# EAGLE design main_board (EAGLE 9.6.2)
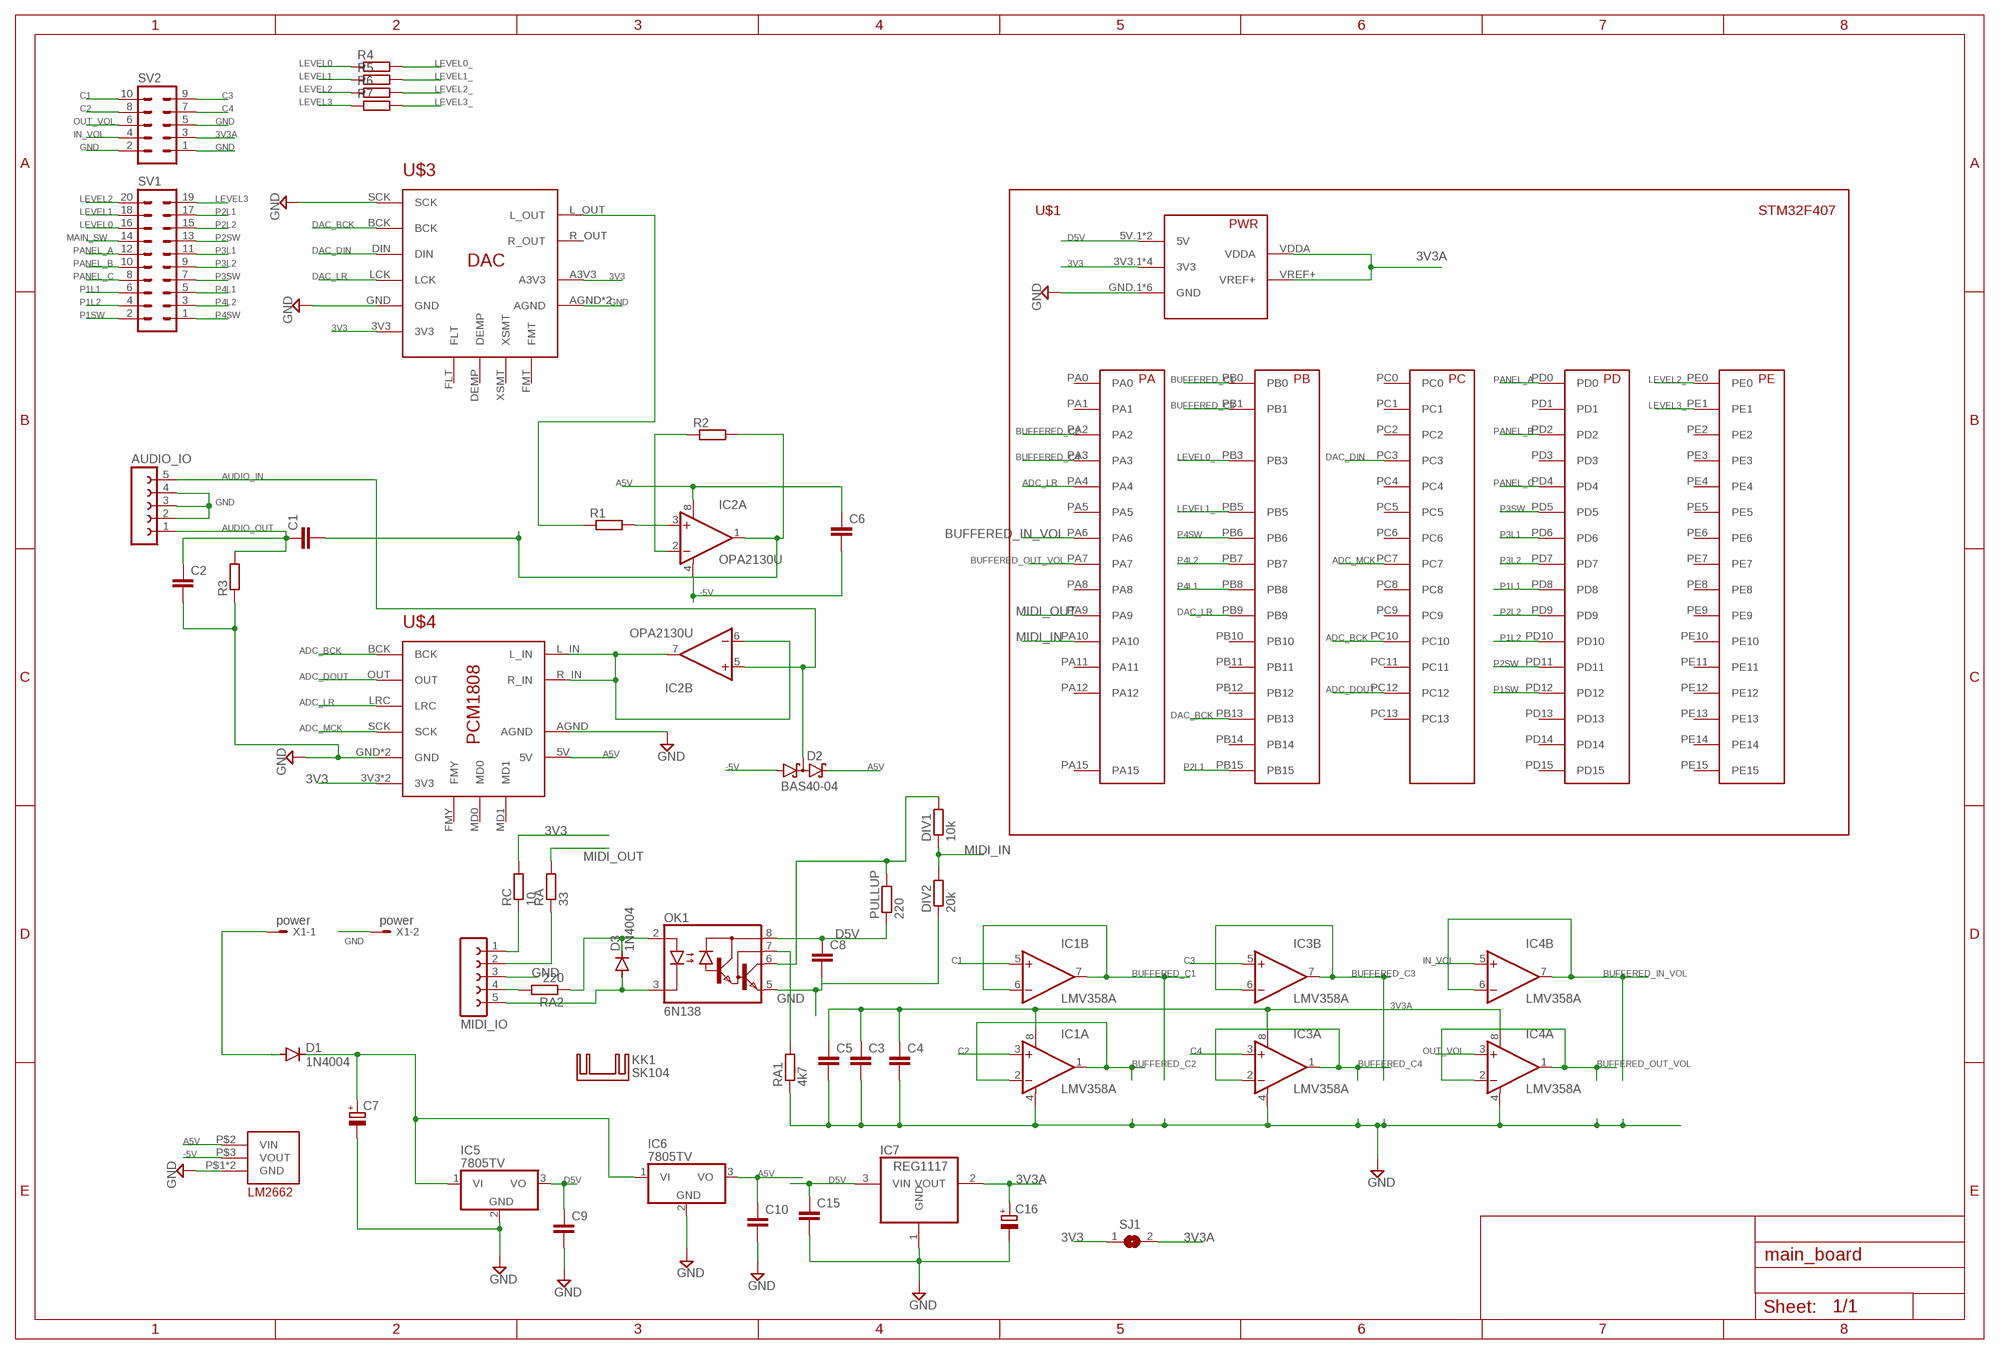
[diagram p0: schematic, sheet 1]

## Parts
AUDIO_IO  FE05-1  [FE05-1]
C1  C5/5.5  [C5B5.5]
C2  C2,5-3  [C2.5-3]
C3  C-EUC0402  [C0402]
C4  C-EUC0402  [C0402]
C5  C-EUC0402  [C0402]
C6  C-EUC0402  [C0402]
C7  CPOL-EUE2.5-7  [E2,5-7]
C8  C-EU025-024X044  [C025-024X044]
C9  C-EU025-024X044  [C025-024X044]
C10  C-EU025-024X044  [C025-024X044]
C15  C-EUC0402  [C0402]
C16  CPOL-EUTT2D6L  [TT2D6L]
D1  1N4004  [DO41-10]
D2  BAS40-04  [SOT23]
D3  1N4004  [DO41-10]
DIV1  10k  R-EU_0204/2V  [0204V]
DIV2  20k  R-EU_0204/2V  [0204V]
IC1  LMV358A  OPA2130U  [SO08]
IC2  OPA2130U  [SO08]
IC3  LMV358A  OPA2130U  [SO08]
IC4  LMV358A  OPA2130U  [SO08]
IC5  7805TV  [TO220V]
IC6  7805TV  [TO220V]
IC7  REG1117  [SOT223]
KK1  SK104  [SK104]
MIDI_IO  FE05-1  [FE05-1]
OK1  6N138  [DIL08]
PULLUP  220  R-EU_0204/2V  [0204V]
R1  R-EU_0204/2V  [0204V]
R2  R-EU_0204/2V  [0204V]
R3  R-EU_0204/2V  [0204V]
R4  R-EU_R0402  [R0402]
R5  R-EU_R0402  [R0402]
R6  R-EU_R0402  [R0402]
R7  R-EU_R0402  [R0402]
RA  33  R-EU_0204/2V  [0204V]
RA1  4k7  R-EU_0204/2V  [0204V]
RA2  220  R-EU_0204/2V  [0204V]
RC  10  R-EU_0204/2V  [0204V]
SJ1  SJ  [SJ]
SV1  MA10-2  [MA10-2]
SV2  MA05-2  [MA05-2]
U$1  DEVEBOX  [DEVEBOX]
U$2  LM2662_MODULE  [LM2662_MODULE]
U$3  PCM510XA  [DAC_MODULE]
U$4  PCM1808  [ADC_MODULE]
X1  power  332-02  [332-02]

## Nets
3V3: RC.2 SJ1.1 U$1.3V3.1(3V3) U$1.3V3.2(3V3) U$1.3V3.3(3V3) U$1.3V3.4(3V3) U$3.3V3 U$3.A3V3 U$4.3V3 U$4.3V3.1(3V3)
3V3A: C3.1 C4.1 C5.1 C16.+ IC1.8(A:V+) IC3.8(A:V+) IC4.8(A:V+) IC7.2(VOUT) SJ1.2 SV2.3 U$1.VDDA U$1.VREF+
-5V: C6.2 D2.1(A1) IC2.4(A:V-) U$2.P$3(VOUT)
A5V: C6.1 C10.1 D2.2(C2) IC2.8(A:V+) IC6.3(VO) U$2.P$2(VIN) U$4.5V
ADC_BCK: U$1.PC10 U$4.BCK
ADC_DOUT: U$1.PC12 U$4.OUT
ADC_LR: U$1.PA4 U$4.LRC
ADC_MCK: U$1.PC7 U$4.SCK
AUDIO_IN: AUDIO_IO.5 D2.3(C1A2) IC2.5(B:+IN)
AUDIO_OUT: R1.1 U$3.L_OUT
BUFFERED_C1: IC1.6(B:-IN) IC1.7(B:OUT) U$1.PB0
BUFFERED_C2: IC1.1(A:OUT) IC1.2(A:-IN) U$1.PA2
BUFFERED_C3: IC3.6(B:-IN) IC3.7(B:OUT) U$1.PB1
BUFFERED_C4: IC3.1(A:OUT) IC3.2(A:-IN) U$1.PA3
BUFFERED_IN_VOL: IC4.6(B:-IN) IC4.7(B:OUT) U$1.PA6
BUFFERED_OUT_VOL: IC4.1(A:OUT) IC4.2(A:-IN) U$1.PA7
C1: IC1.5(B:+IN) SV2.10
C2: IC1.3(A:+IN) SV2.8
C3: IC3.5(B:+IN) SV2.9
C4: IC3.3(A:+IN) SV2.7
D5V: C8.1 C9.1 C15.1 IC5.3(VO) IC7.3(VIN) OK1.8(VCC) PULLUP.1 U$1.5V.1(5V) U$1.5V.2(5V)
DAC_BCK: U$1.PB13 U$3.BCK
DAC_DIN: U$1.PC3 U$3.DIN
DAC_LR: U$1.PB9 U$3.LCK
GND: AUDIO_IO.2 AUDIO_IO.3 AUDIO_IO.4 C2.2 C3.2 C4.2 C5.2 C7.- C8.2 C9.2 C10.2 C15.2 C16.- DIV2.1 IC1.4(A:V-) IC3.4(A:V-) IC4.4(A:V-) IC5.2(GND) IC6.2(GND) IC7.1(GND) MIDI_IO.3 OK1.5(GND) R3.1 RA1.1 SV2.1 SV2.2 SV2.5 U$1.GND4.(GND) U$1.GND.1(GND) U$1.GND.2(GND) U$1.GND.3(GND) U$1.GND.6(GND) U$1.GND.7(GND) U$2.P$1(GND) U$2.P$4(GND) U$3.AGND U$3.AGND.1(AGND) U$3.GND U$3.SCK U$4.AGND U$4.GND U$4.GND.1(GND) X1.2
IN_VOL: IC4.5(B:+IN) SV2.4
LEVEL0: R4.1 SV1.16
LEVEL0_: R4.2 U$1.PB3
LEVEL1: R5.1 SV1.18
LEVEL1_: R5.2 U$1.PB5
LEVEL2: R6.1 SV1.20
LEVEL2_: R6.2 U$1.PE0
LEVEL3: R7.1 SV1.19
LEVEL3_: R7.2 U$1.PE1
MAIN_SW: SV1.14
MIDI_IN: DIV1.1 DIV2.2 U$1.PA10
MIDI_OUT: RA.2 U$1.PA9
N$1: C7.+ D1.C IC5.1(VI) IC6.1(VI)
N$2: IC2.6(B:-IN) IC2.7(B:OUT) U$4.L_IN U$4.R_IN
N$3: D1.A X1.1
N$4: AUDIO_IO.1 C1.1 C2.1 R3.2
N$5: D3.A MIDI_IO.5 OK1.3(C)
N$6: D3.C OK1.2(A) RA2.1
N$7: DIV1.2 OK1.6(VO) PULLUP.2
N$8: MIDI_IO.1 RC.1
N$9: MIDI_IO.2 RA.1
N$11: IC2.3(A:+IN) R1.2
N$12: C1.2 IC2.1(A:OUT) R2.2
N$13: IC2.2(A:-IN) R2.1
N$14: OK1.7(VB) RA1.2
N$15: MIDI_IO.4 RA2.2
OUT_VOL: IC4.3(A:+IN) SV2.6
P1L1: SV1.6 U$1.PD8
P1L2: SV1.4 U$1.PD10
P1SW: SV1.2 U$1.PD12
P2L1: SV1.17 U$1.PB15
P2L2: SV1.15 U$1.PD9
P2SW: SV1.13 U$1.PD11
P3L1: SV1.11 U$1.PD6
P3L2: SV1.9 U$1.PD7
P3SW: SV1.7 U$1.PD5
P4L1: SV1.5 U$1.PB8
P4L2: SV1.3 U$1.PB7
P4SW: SV1.1 U$1.PB6
PANEL_A: SV1.12 U$1.PD0
PANEL_B: SV1.10 U$1.PD2
PANEL_C: SV1.8 U$1.PD4
Unconnected: U$1.PA0 U$1.PA1 U$1.PA5 U$1.PA8 U$1.PA11 U$1.PA12 U$1.PA15 U$1.PB10 U$1.PB11 U$1.PB12 U$1.PB14 U$1.PC0 U$1.PC1 U$1.PC2 U$1.PC4 U$1.PC5 U$1.PC6 U$1.PC8 U$1.PC9 U$1.PC11 U$1.PC13 U$1.PD1 U$1.PD3 U$1.PD13 U$1.PD14 U$1.PD15 U$1.PE2 U$1.PE3 U$1.PE4 U$1.PE5 U$1.PE6 U$1.PE7 U$1.PE8 U$1.PE9 U$1.PE10 U$1.PE11 U$1.PE12 U$1.PE13 U$1.PE14 U$1.PE15 U$3.DEMP U$3.FLT U$3.FMT U$3.R_OUT U$3.XSMT U$4.FMY U$4.MD0 U$4.MD1

## Library data of the parts
AUDIO_IO MIDI_IO = con-lsta:FE05-1: FEMALE HEADER; OC_FARNELL: unknown; OC_NEWARK: unknown
C1 C2 = capacitor-wima:C: CAPACITOR naming: grid - package width
C3-C6 C8-C10 C15 = rcl:C-EU: CAPACITOR, European symbol; SPICEPREFIX: C
C7 C16 = rcl:CPOL-EU: POLARIZED CAPACITOR, European symbol; SPICEPREFIX: C
D1 D3 = diode:1N4004: DIODE general purpose rectifier, 1 A
D2 = diode:BAS40-04: Silicon Schottky Diodes General-purpose diode for high-speed switching
DIV1 DIV2 PULLUP R1-R7 RA RA1 RA2 RC = rcl:R-EU_: RESISTOR, European symbol; SPICEPREFIX: R
IC1-IC4 = burr-brown:OPA2130: Operational Amplifier; MF: TEXAS INSTRUMENTS; MPN: OPA2130UA; OC_FARNELL: 1459554; OC_NEWARK: 35C1841
IC5 IC6 = linear:78*: Positive VOLTAGE REGULATOR Source: http://cache.national.com/ds/LM/LM78L05.pdf http://www.fairchildsemi.com/ds/LM/LM7805.pdf
IC7 = burr-brown:REG1117: 800mA and 1A Low Dropout (LDO) Positive Regulator 1.8V, 2.5V, 2.85V, 3.3V, 5V, and Adj; MPN: REG1117; OC_FARNELL: 1097566; OC_NEWARK: 14P6981
KK1 = heatsink:SK104: HEATSINK manufacturer Fischer/distributor Buerklin
OK1 = optocoupler:6N138: MOTOROLA OPTO COUPLER; MF: VISHAY/TELEFUNKEN; MPN: 6N138; OC_FARNELL: 9860150; OC_NEWARK: 35K5294
SJ1 = jumper:SJ: SMD solder JUMPER
SV1 = con-lstb:MA10-2: PIN HEADER; OC_FARNELL: unknown; OC_NEWARK: unknown
SV2 = con-lstb:MA05-2: PIN HEADER; OC_FARNELL: unknown; OC_NEWARK: unknown
U$1 = ali_modules:DEVEBOX
U$2 = ali_modules:LM2662_MODULE
U$3 = ali_modules:PCM510XA
U$4 = ali_modules:PCM1808
X1 = con-garry:332-02: 2 Pin - 2mm Dual Row Source: www.mpe-connector.de / garry_shortform_2012.pdf

## Board
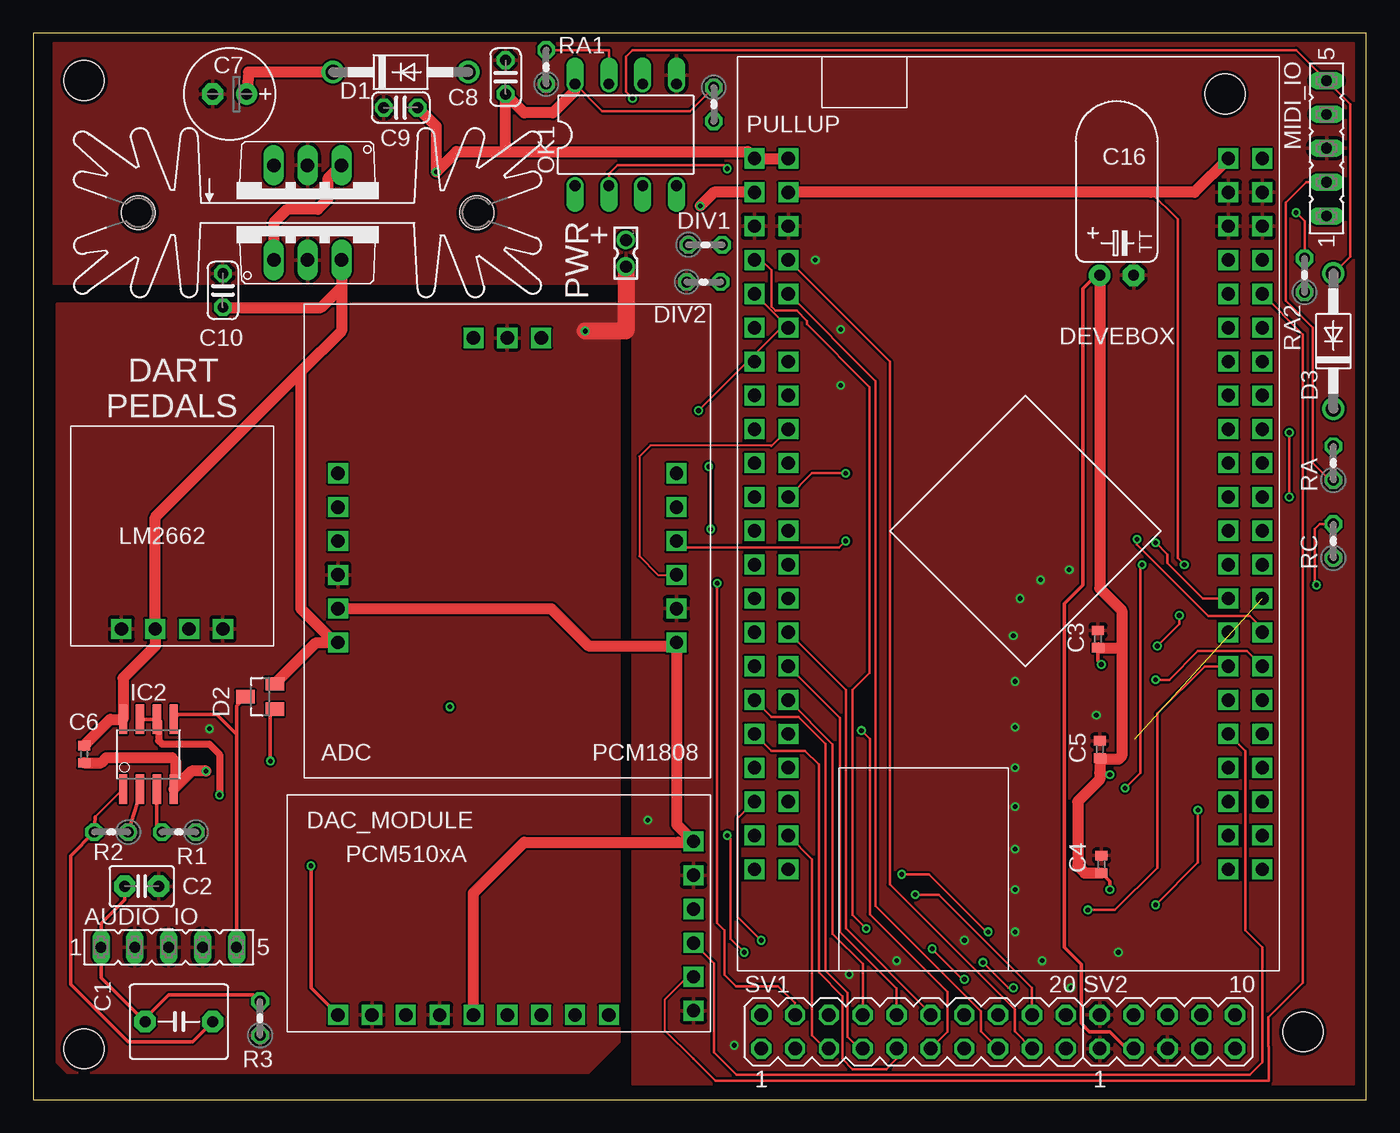
[diagram p1: board, top side]
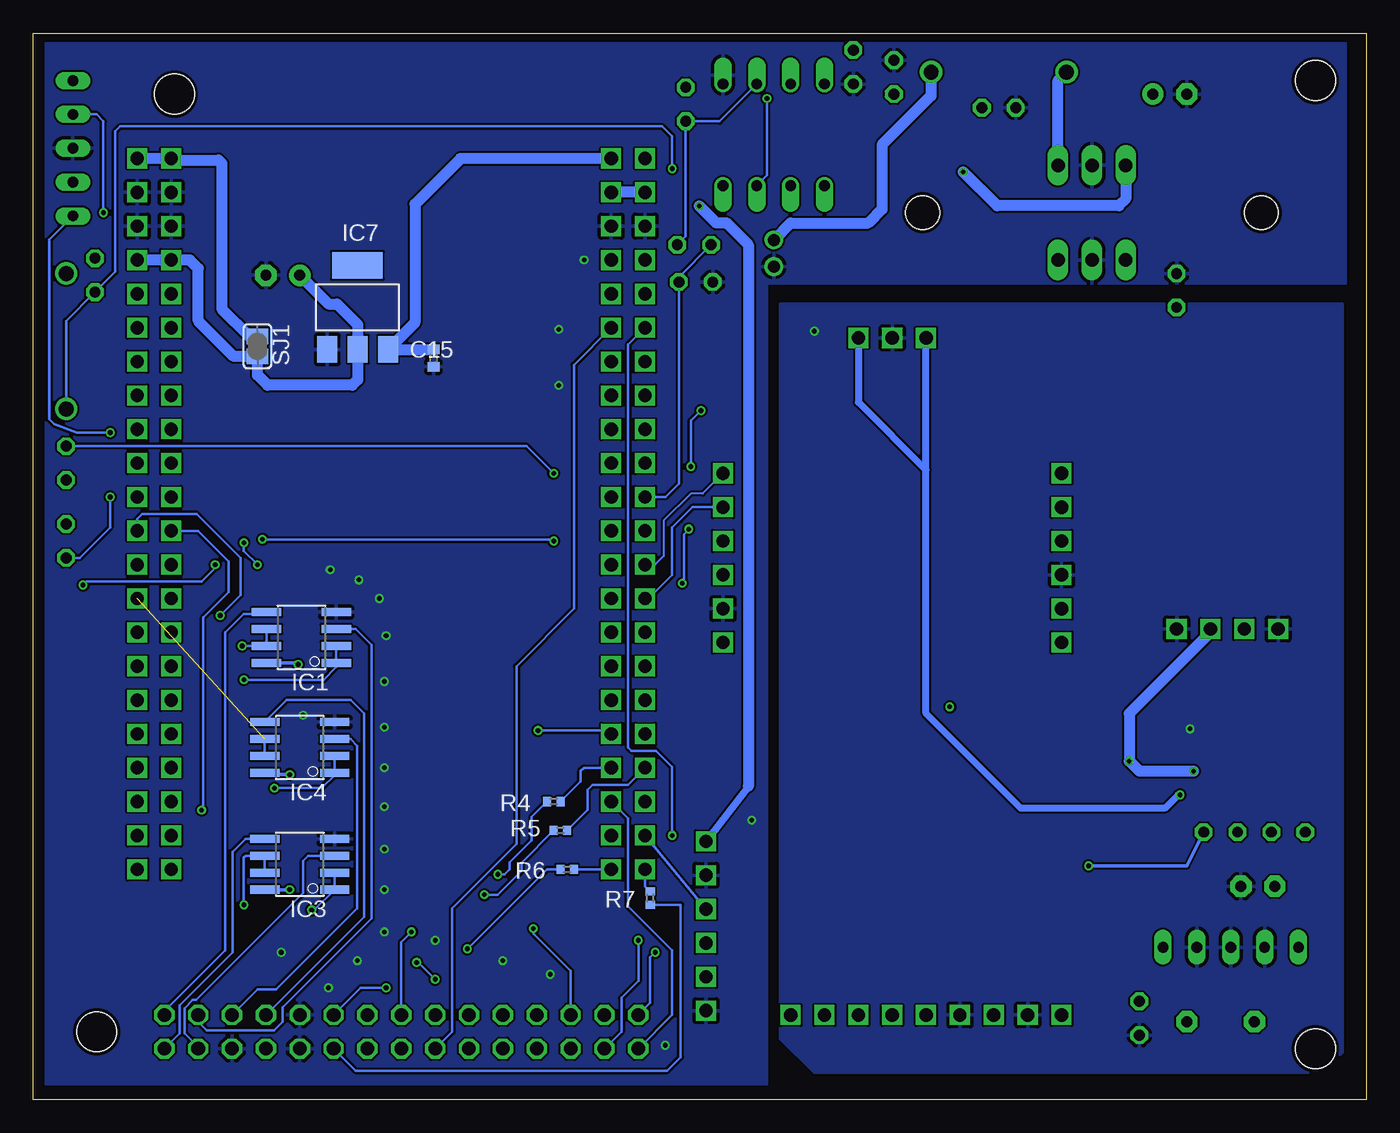
[diagram p2: board, bottom side, seen from below]

Size 100 x 80 mm. Coordinates in mm from the lower left corner, seen from the top.
Outline: 0,0 100,0 100,80 0,80 0,0
Copper layers (1*16): Top 0.035mm / dielectric 1.5mm / Bottom 0.035mm
Design rules "SeeedStudio_2layer_DRU_no_angle_20140221": minimum track width 6mil, minimum drill 12mil, track to track 6mil, track to pad 6mil, pad to pad 6mil, via to via 6mil, smd to smd 0mil, copper to edge 10mil, drill to drill 10mil, minimum pad ring 10mil, minimum via ring 6mil, stop-mask expansion 2mil, vias tented up to drill 100mil, thermal gap 10mil
Holes 3 mm at 3.81,76.45 89.41,75.44 95.25,5.08 3.81,3.81

### Footprints (pad centres in the part's own frame; a part is rotated, then mirrored left to right if it is on the bottom)
FE05-1 = drill 0.813 long: 1 -5.08,0; 2 -2.54,0; 3 0,0; 4 2.54,0; 5 5.08,0
C5B5.5 = drill 0.813 pad 1.6 octagon: 1 -2.54,0; 2 2.54,0
C2.5-3 = drill 0.813 pad 1.6 octagon: 1 -1.27,0; 2 1.27,0
C0402 = smd 0.7 x 0.9: 1 -0.65,0; 2 0.65,0
E2,5-7 = drill 0.813 pad 1.6: + -1.27,0 | drill 0.813 pad 1.6 octagon: - 1.27,0
C025-024X044 = drill 0.813 octagon: 1 -1.27,0; 2 1.27,0
TT2D6L = drill 0.813 pad 1.6: + -1.27,0 | drill 0.813 pad 1.6 octagon: - 1.27,0
DO41-10 = drill 1.118: A 5.08,0; C -5.08,0
SOT23 = smd 1 x 1.4: 1 -0.95,-1.1; 2 0.95,-1.1; 3 0,1.1
0204V = drill 0.813 octagon: 1 -1.27,0; 2 1.27,0
SO08 = smd 0.61 x 2.21: 1 -1.905,-2.616; 2 -0.635,-2.616; 3 0.635,-2.616; 4 1.905,-2.616; 5 1.905,2.616; 6 0.635,2.616; 7 -0.635,2.616; 8 -1.905,2.616
TO220V = drill 1.016 long: 1 -2.54,-2.54; 2 0,-2.54; 3 2.54,-2.54
SOT223 = smd 1.499 x 2.007: 1 -2.261,-3.15; 2 0.025,-3.15; 3 2.311,-3.15 | smd 3.81 x 2.007: 4 0,3.15
SK104 = hole 2.54: -12.7,-0.762; 12.7,-0.762
DIL08 = drill 0.813 offset: 1 -3.81,-3.81; 2 -1.27,-3.81; 3 1.27,-3.81; 4 3.81,-3.81; 5 3.81,3.81; 6 1.27,3.81; 7 -1.27,3.81; 8 -3.81,3.81
R0402 = smd 0.6 x 0.7: 1 -0.5,0; 2 0.5,0
SJ = smd 1.168 x 1.6: 1 -0.762,0; 2 0.762,0
MA10-2 = drill 1.016 octagon: 1 -11.43,-1.27; 2 -11.43,1.27; 3 -8.89,-1.27; 4 -8.89,1.27; 5 -6.35,-1.27; 6 -6.35,1.27; 7 -3.81,-1.27; 8 -3.81,1.27; 9 -1.27,-1.27; 10 -1.27,1.27; 11 1.27,-1.27; 12 1.27,1.27; 13 3.81,-1.27; 14 3.81,1.27; 15 6.35,-1.27; 16 6.35,1.27; 17 8.89,-1.27; 18 8.89,1.27; 19 11.43,-1.27; 20 11.43,1.27
MA05-2 = drill 1.016 octagon: 1 -5.08,-1.27; 2 -5.08,1.27; 3 -2.54,-1.27; 4 -2.54,1.27; 5 0,-1.27; 6 0,1.27; 7 2.54,-1.27; 8 2.54,1.27; 9 5.08,-1.27; 10 5.08,1.27
DEVEBOX = drill 1 square: 3V3.1 17.78,27.94; 3V3.2 20.32,27.94; 3V3.3 -17.78,25.4; 3V3.4 -15.24,25.4; 5V.1 -17.78,27.94; 5V.2 -15.24,27.94; GND4. 20.32,22.86; GND.1 17.78,25.4; GND.2 20.32,25.4; GND.3 17.78,22.86; GND.6 -17.78,22.86; GND.7 -15.24,22.86; PA0 20.32,-12.7; PA1 17.78,-12.7; PA2 20.32,-10.16; PA3 17.78,-10.16; PA4 20.32,-7.62; PA5 17.78,-7.62; PA6 20.32,-5.08; PA7 17.78,-5.08; PA8 -17.78,5.08; PA9 -15.24,2.54; PA10 -17.78,2.54; PA11 -15.24,0; PA12 -17.78,0; PA15 -15.24,-2.54; PB0 20.32,0; PB1 17.78,0; PB3 -15.24,-17.78; PB5 -17.78,-17.78; PB6 -15.24,-20.32; PB7 -17.78,-20.32; PB8 -15.24,-22.86; PB9 -17.78,-22.86; PB10 17.78,12.7; PB11 20.32,15.24; PB12 17.78,15.24; PB13 20.32,17.78; PB14 17.78,17.78; PB15 -15.24,20.32; PC0 20.32,-17.78; PC1 17.78,-17.78; PC2 20.32,-15.24; PC3 17.78,-15.24; PC4 20.32,-2.54; PC5 17.78,-2.54; PC6 -17.78,10.16; PC7 -15.24,7.62; PC8 -17.78,7.62; PC9 -15.24,5.08; PC10 -17.78,-2.54; PC11 -15.24,-5.08; PC12 -17.78,-5.08; PC13 17.78,-20.32; PD0 -15.24,-7.62; PD1 -17.78,-7.62; PD2 -15.24,-10.16; PD3 -17.78,-10.16; PD4 -15.24,-12.7; PD5 -17.78,-12.7; PD6 -15.24,-15.24; PD7 -17.78,-15.24; PD8 -17.78,20.32; PD9 -15.24,17.78; PD10 -17.78,17.78; PD11 -15.24,15.24; PD12 -17.78,15.24; PD13 -15.24,12.7; PD14 -17.78,12.7; PD15 -15.24,10.16; PE0 -15.24,-25.4; PE1 -17.78,-25.4; PE2 20.32,-25.4; PE3 17.78,-25.4; PE4 20.32,-22.86; PE5 17.78,-22.86; PE6 20.32,-20.32; PE7 20.32,2.54; PE8 17.78,2.54; PE9 20.32,5.08; PE10 17.78,5.08; PE11 20.32,7.62; PE12 17.78,7.62; PE13 20.32,10.16; PE14 17.78,10.16; PE15 20.32,12.7; VDDA 17.78,20.32; VREF+ 20.32,20.32
LM2662_MODULE = drill 1 square: P$1 -3.81,2.54; P$2 -3.81,0; P$3 -3.81,-2.54; P$4 -3.81,-5.08
DAC_MODULE = drill 1 square: 3V3 -17.78,-6.668; A3V3 -1.27,6.35; AGND 6.35,6.35; AGND.1 1.27,6.35; BCK -17.78,3.493; DEMP -8.89,6.35; DIN -17.78,0.953; FLT -11.43,6.35; FMT -3.81,6.35; GND -17.78,-4.128; L_OUT 8.89,6.35; LCK -17.78,-1.587; R_OUT 3.81,6.35; SCK -17.78,6.032; XSMT -6.35,6.35
ADC_MODULE = drill 1 square: 3V3 -10.16,-5.08; 3V3.1 15.24,-7.62; 5V -10.16,-7.62; AGND 2.54,15.24; BCK 15.24,5.08; FMY -10.16,5.08; GND -10.16,-2.54; GND.1 15.24,-5.08; L_IN 5.08,15.24; LRC 15.24,0; MD0 -10.16,0; MD1 -10.16,2.54; OUT 15.24,2.54; R_IN 0,15.24; SCK 15.24,-2.54
332-02 = drill 0.9 pad 1.27: 1 0,-1; 2 0,1

### Placement (x,y rotation side)
AUDIO_IO  10.16,11.43 0 top
C1  10.92,5.84 0 top
C2  8.13,16 0 top
C3  79.88,34.54 90 top
C4  80.14,17.65 90 top
C5  80.01,26.27 90 top
C6  3.81,25.91 270 top
C7  14.73,75.44 180 top
C8  35.43,76.71 90 top
C9  27.56,74.42 180 top
C10  14.22,60.71 90 top
C15  69.98,55.63 270 bottom
C16  81.28,61.85 0 top
D1  27.56,77.09 0 top
D2  17.02,30.23 90 top
D3  97.54,56.9 90 top
DIV1  50.42,64.14 0 top
DIV2  50.29,61.34 0 top
IC1  79.88,34.67 90 bottom
IC2  8.64,25.91 0 top
IC3  80.01,17.65 90 bottom
IC4  80.01,26.42 90 bottom
IC5  20.57,67.56 180 top
IC6  20.57,65.53 0 top
IC7  75.69,59.44 0 bottom
KK1  20.57,67.31 0 top
MIDI_IO  97.03,71.37 90 top
OK1  44.45,72.39 0 top
PULLUP  51.05,74.68 270 top
R1  10.92,20.07 180 top
R2  5.84,20.07 180 top
R3  17.02,6.1 90 top
R4  60.96,22.35 0 bottom
R5  60.45,20.19 0 bottom
R6  59.94,17.27 0 bottom
R7  53.72,15.11 90 bottom
RA  97.54,47.75 90 top
RA1  38.48,77.47 90 top
RA2  95.38,61.85 90 top
RC  97.54,41.91 90 top
SJ1  83.19,56.52 270 bottom
SV1  66.04,5.08 0 top
SV2  85.09,5.08 0 top
U$1  71.88,42.67 0 top
U$2  9.14,39.12 90 top
U$3  31.75,12.7 180 top
U$4  33.02,41.91 0 top
X1  44.45,63.5 180 top

### Tracks (layer width: path | path; a pad name or v marks a point on that pad's centre or on a via)
3V3  (via drill 0.35)
  Top 0.203: v86.36,40.13 85.85,40.64 85.85,66.04 83.82,68.07 | v96.27,38.61 96.14,38.73 96.14,42.8 96.52,43.18 RC.2
  Top 0.813: U$1.3V3.1 87.12,68.07 83.82,68.07 U$1.3V3.4 | U$3.A3V3 33.02,15.49 36.83,19.3 48.39,19.3 49.47,19.3 U$3.3V3 48.26,20.64 U$4.3V3.1 48.01,34.04 41.66,34.04 38.86,36.83 U$4.3V3 | U$1.3V3.3 51.05,68.07 v50.04,67.06
  Bottom 0.203: v96.27,38.61 96.01,38.86 87.38,38.86 86.36,39.88 v86.36,40.13
  Bottom 0.508: 46.35,23.5 U$3.3V3
  Bottom 0.813: 46.35,23.5 46.35,64.14 48.01,65.79 48.77,65.79 v50.04,67.06 | U$1.3V3.2 U$1.3V3.1 89.53,70.48 86.11,70.48 85.85,70.23 85.85,59.31 83.82,57.28 SJ1.1 | U$1.3V3.3 U$1.3V3.4
3V3A  (via drill 0.35)
  Top 0.254: v80.14,32.64 79.88,32.89 C3.1 | 80.01,24.51 80.64,24.51 v80.77,24.38 | C4.1 80.77,16.37 v80.77,15.75 | SV2.3 82.04,3.81 80.77,5.08 79.25,5.08 78.61,5.71 78.61,10.16 77.34,11.43 77.34,37.21 78.74,38.61 78.74,60.83 79.76,61.85 C16.+
  Top 0.813: C16.+ 80.01,38.35 81.66,36.7 81.66,33.91 | 81.66,33.91 81.66,25.78 81.41,25.53 80.11,25.53 C5.1 80.01,24.51 80.01,24 78.36,22.35 78.36,17.53 78.88,17 C4.1 | C3.1 81.65,33.89 81.66,33.91
  Bottom 0.254: IC1.8 80.26,32.77 v80.14,32.64 | v80.77,24.38 82.5,24.38 IC4.8 | v80.77,15.75 IC3.8
  Bottom 0.813: C16.+ 77.85,59.69 77.22,59.69 75.67,58.14 IC7.2 75.67,54 76.07,53.59 82.42,53.59 83.19,54.36 SJ1.2 84.96,55.75 87.63,58.42 87.63,62.36 88.27,62.99 U$1.VDDA U$1.VREF+
-5V  (via drill 0.35)
  Top 0.254: D2.1 17.78,28.94 v17.78,25.4 | 10.41,25.65 10.67,25.4 | 10.67,23.42 IC2.4
  Top 0.813: v12.95,24.64 11.89,24.64 IC2.4 | C6.2 5.08,25.26 5.48,25.65 10.41,25.65 | 10.67,25.4 10.67,23.42
  Bottom 0.813: v12.95,24.64 17.02,24.64 v17.78,25.4 17.78,28.96 11.68,35.05 U$2.P$3
A5V
  Top 0.813: D2.2 21.23,34.29 U$4.5V 22.61,34.29 20.07,36.83 20.07,54.61 | 20.07,54.61 23.11,57.66 23.11,60.96 | IC6.3 23.11,60.96 | 20.07,54.61 9.14,43.69 U$2.P$2 9.14,34.04 6.73,31.62 IC2.8 5.78,28.52 C6.1 | C10.1 21.59,59.44 23.11,60.96
ADC_BCK
  Bottom 0.152: U$4.BCK 49.78,45.47 50.67,45.47 52.7,43.43 52.7,40.77 53.34,40.13 U$1.PC10
ADC_DOUT
  Bottom 0.203: U$4.OUT 50.55,44.45 52.07,42.93 52.07,39.37 53.85,37.59 U$1.PC12
ADC_LR  (via drill 0.35)
  Top 0.203: v60.96,41.91 60.45,41.4 48.77,41.4 U$4.LRC | v82.8,42.04 82.8,41.66 88.17,36.29 91.27,36.29 92.2,35.36 U$1.PA4
  Bottom 0.203: v60.96,41.91 61.09,42.04 v82.8,42.04
ADC_MCK
  Top 0.152: U$1.PC7 55.44,49.09 | 55.37,49.02 55.44,49.09 | 55.44,49.09 46.29,49.09 45.47,48.26 45.47,40.77 46.86,39.37 U$4.SCK
AUDIO_IN
  Top 0.254: IC2.5 10.9,28.88 13.74,28.88 15.24,27.38 | AUDIO_IO.5 15.24,27.38 | 15.24,27.38 15.24,29.55 D2.3
AUDIO_OUT  (via drill 0.35)
  Top 0.254: U$3.L_OUT 20.83,8.38 v20.83,17.53
  Bottom 0.254: v20.83,17.53 13.46,17.53 R1.1
BUFFERED_C1  (via drill 0.35)
  Top 0.203: v84.33,34.04 85.98,35.69 v85.98,36.32
  Bottom 0.203: IC1.6 IC1.7 v84.33,34.04 | v85.98,36.32 84.45,37.85 84.45,40.64 87.76,43.94 91.82,43.94 92.2,43.56 U$1.PB0
BUFFERED_C2  (via drill 0.35)
  Top 0.203: v84.2,31.5 85.22,31.5 87.38,33.66 91.06,33.66 U$1.PA2
  Bottom 0.203: IC1.2 IC1.1 77.27,32.46 78.23,31.5 v84.2,31.5
BUFFERED_C3  (via drill 0.35)
  Top 0.203: v87.38,21.72 87.38,17.78 v84.2,14.61
  Bottom 0.203: IC3.7 IC3.6 84.07,18.29 84.2,18.16 v84.2,14.61 | U$1.PB1 87.63,42.67 85.34,40.39 85.34,38.07 87.25,36.16 87.25,21.84 v87.38,21.72
BUFFERED_C4  (via drill 0.35)
  Top 0.203: U$1.PA3 87.88,32.51 84.33,28.96 84.33,17.4 81.15,14.22 v79.12,14.22
  Bottom 0.203: IC3.2 IC3.1 78.92,14.22 v79.12,14.22
BUFFERED_IN_VOL  (1 unrouted)
  Bottom 0.203: IC4.6 IC4.7
BUFFERED_OUT_VOL  (via drill 0.35)
  Top 0.203: v83.19,40.13 83.06,40.01 83.06,24.51 v81.92,23.37 | v84.2,41.78 85.09,40.89 85.09,40.26 87.76,37.59 U$1.PA7
  Bottom 0.203: IC4.2 IC4.1 77.39,24.33 78.36,23.37 v81.92,23.37 | v84.2,41.78 84.2,41.15 v83.19,40.13
C1
  Bottom 0.203: SV2.10 90.17,6.6 85.6,11.18 85.6,35.05 84.2,36.45 82.63,36.45 IC1.5
C2
  Bottom 0.203: SV2.8 87.63,5.84 87,5.21 81.92,5.21 81.28,5.84 81.28,6.93 74.62,13.59 74.62,34.11 75.82,35.31 IC1.3
C3
  Bottom 0.203: SV2.9 89.03,4.95 89.03,7.06 85.04,11.05 85.04,18.59 84.07,19.56 IC3.5
C4
  Bottom 0.203: SV2.7 87.63,3.94 88.65,4.95 88.65,6.86 88.04,7.47 87.78,7.47 79.76,15.49 79.76,17.91 79.38,18.29 IC3.3
D5V  (via drill 0.35)
  Top 0.203: OK1.8 42.67,74.17 49.28,74.17 PULLUP.1
  Top 0.813: 35.31,71.12 35.43,71.25 C8.1 36.83,74.04 38.99,74.04 40.64,75.69 OK1.8 | 35.31,71.12 31.75,71.12 v30.23,69.6 30.23,73.03 C9.1 | 35.31,71.12 53.59,71.12 U$1.5V.1 U$1.5V.2
  Bottom 0.813: IC5.3 18.03,67.56 18.54,67.06 27.69,67.06 v30.23,69.6 | U$1.5V.2 67.94,70.61 71.37,67.18 71.37,58.29 IC7.3 73.37,56.28 C15.1
DAC_BCK
  Top 0.152: U$3.BCK 49.09,9.21 47.37,7.49 47.37,5.21 49.53,3.05
  Top 0.203: U$1.PB13 95.25,57.4 95.25,8.75 92.66,6.15 92.66,4.01 92.71,3.95 92.71,1.4 51.18,1.4 49.53,3.05
DAC_DIN
  Top 0.203: U$1.PC3 90.93,26.16 90.93,12.7 92.2,11.43 92.2,2.79 91.26,1.85 52.76,1.85 51.05,3.56 51.05,10.22 U$3.DIN
DAC_LR
  Bottom 0.203: U$3.LCK U$1.PB9
GND  (via drill 0.35)
  Top 1.27: X1.2 44.45,57.66 v41.4,57.66
  other vias: 58.67,62.99 52.58,4.06 61.21,9.4 64.77,10.41 13.21,27.81 60.58,53.59 60.58,57.78 77.72,39.75 75.56,38.99 74.04,37.59 73.53,34.8 73.66,31.37 73.66,27.94 73.66,24.89 73.66,21.97 73.66,18.8 73.66,15.75 73.66,12.57 75.69,10.41 77.85,8.38 46.1,20.95 79.76,28.83 69.85,11.94 81.41,11.05
  pour Bottom: 1.78,59.69 43.94,59.69 43.94,4.57 41.4,2.03 3.3,2.03 1.78,3.56
  pour Top: 43.94,59.69 43.94,4.32 41.66,2.03 2.54,2.03 1.78,2.79 1.78,59.69
  pour Top: 1.52,79.25 99.06,79.25 99.06,1.14 44.96,1.14 44.96,61.21 1.52,61.21
  pour Bottom: 1.52,79.25 99.06,79.25 99.06,1.14 44.96,1.14 44.96,61.21 1.52,61.21
IN_VOL
  Bottom 0.203: SV2.4 75.18,13.72 75.18,28.96 76.2,29.97 80.97,29.97 IC4.5
LEVEL0  (via drill 0.35)
  Top 0.203: v65.15,16.89 67.18,16.89 71.5,12.57 v71.63,12.57
  Bottom 0.203: v65.15,16.89 64.64,16.89 64.26,17.27 64.26,17.78 62.61,19.43 62.61,21.2 R4.1 | v71.63,12.57 72.39,11.81 SV1.16
LEVEL0_
  Bottom 0.203: R4.2 58.93,23.88 58.93,24.64 58.67,24.89 U$1.PB3
LEVEL1  (via drill 0.35)
  Top 0.203: v66.17,15.37 67.94,15.37 74.93,8.38 SV1.18
  Bottom 0.203: v66.17,15.37 65.15,15.37 63.37,17.14 63.37,17.77 R5.1
LEVEL1_
  Bottom 0.203: R5.2 58.42,21.73 58.42,23.24 58.04,23.62 55.37,23.62 U$1.PB5
LEVEL2  (via drill 0.35)
  Top 0.203: v67.44,11.3 69.72,9.02 v69.85,9.02 | v71.25,10.29 73.15,8.38 v73.53,8.38
  Bottom 0.203: v67.44,11.3 61.47,17.27 R6.1 | v69.85,9.02 71.12,10.29 v71.25,10.29 | v73.53,8.38 75.44,8.38 SV1.20
LEVEL2_
  Bottom 0.203: R6.2 U$1.PE0
LEVEL3
  Bottom 0.203: SV1.19 75.82,2.16 52.45,2.16 51.44,3.17 51.44,14.61 R7.1
LEVEL3_
  Bottom 0.203: U$1.PE1 54.1,15.99 R7.2
MIDI_IN
  Bottom 0.203: DIV1.1 51.56,61.72 DIV2.2 51.56,46.23 52.58,45.21 U$1.PA10
MIDI_OUT  (via drill 0.35)
  Top 0.203: U$1.PA9 58.42,46.99 v60.96,46.99
  Bottom 0.203: v60.96,46.99 62.99,49.02 RA.2
N$1
  Top 0.813: IC5.1 22.1,69.09 22.1,67.56 21.34,66.8 19.05,66.8 18.03,65.79 IC6.1 | D1.C 16.15,77.09 C7.+
  Bottom 0.813: IC5.1 23.11,76.45 D1.C
N$2  (via drill 0.35)
  Top 0.254: IC2.7 IC2.6 9.4,28.4
  Top 0.508: 9.4,28.4 9.4,26.92 9.65,26.67 13.21,26.67 13.97,25.91 v13.97,22.86
  Bottom 0.508: v13.97,22.86 14.1,22.86 15.11,21.84 25.91,21.84 33.02,28.96 33.02,47.24 | 33.02,47.24 U$4.R_IN | U$4.L_IN 38.1,52.32 33.02,47.24
N$3
  Bottom 0.813: D1.A 32.64,75.31 36.32,71.63 36.32,66.8 37.35,65.77 43.18,65.77 X1.1
N$4
  Top 0.254: C2.1 6.86,14.99 5.08,13.21 AUDIO_IO.1 5.08,9.14 C1.1 8.38,6.1 10.16,7.87 16.51,7.87 R3.2
N$5  (via drill 0.35)
  Top 0.203: v44.96,75.11 44.45,75.61 44.45,78.23 44.96,78.74 94.74,78.74 MIDI_IO.5 98.81,74.68 98.81,63.25 D3.A
  Bottom 0.203: OK1.3 44.96,69.34 v44.96,75.11
N$6  (via drill 0.35)
  Top 0.203: v52.07,69.85 51.82,70.1 43.81,70.1 43.18,69.47 OK1.2
  Bottom 0.203: D3.C 97.54,58.42 RA2.1 93.85,62.1 93.85,72.64 93.47,73.03 52.83,73.03 52.07,72.26 v52.07,69.85
N$7
  Bottom 0.203: OK1.6 48.51,73.41 PULLUP.2 51.05,64.77 DIV1.2
N$8  (via drill 0.35)
  Top 0.203: v94.23,50.04 v94.23,45.21
  Bottom 0.203: v94.23,50.04 96.76,50.04 98.42,50.67 98.81,51.05 98.81,64.52 MIDI_IO.1 | v94.23,45.21 94.23,42.93 96.52,40.64 RC.1
N$9
  Top 0.203: RA.1 97.28,46.48 96.01,47.75 96.01,57.91 93.98,59.94 93.98,67.31 95.5,68.83 MIDI_IO.2
N$10  (via drill 0.35)
  other vias: 31.24,29.46
N$11
  Top 0.254: R1.2 9.27,20.45 IC2.3
N$12
  Top 0.203: 4.64,21.2 IC2.1
  Top 0.254: R2.2 | R2.2 4.64,21.2 | C1.2 11.94,4.32 7.11,4.32 2.79,8.64 2.79,18.3 R2.2
N$13
  Top 0.254: R2.1 8,22.93 IC2.2
N$14
  Top 0.203: OK1.7 43.18,78.74 RA1.2
N$15  (via drill 0.35)
  Top 0.203: RA2.2 95.38,65.91 v94.74,66.55
  Bottom 0.203: v94.74,66.55 94.74,73.41 95.25,73.91 MIDI_IO.4
OUT_VOL
  Bottom 0.203: SV2.6 83.19,8.26 81.79,8.26 75.69,14.35 75.69,26.54 76.2,27.05 IC4.3
P1L1  (via drill 0.35)
  Top 0.203: U$1.PD8 54.61,62.99 55.37,62.23 55.37,59.51 55.7,59.18 57.28,59.18 58.04,58.42 58.04,58.17 62.74,53.47 62.74,32 61.47,30.73 61.47,13.84 v62.48,12.83
  Bottom 0.203: v62.48,12.83 62.48,12.45 59.69,9.65 SV1.6
P1L2  (via drill 0.35)
  Top 0.152: SV1.4 57.15,7.24
  Top 0.203: v51.31,38.73 51.31,13.26 51.87,12.7 51.87,9.35 52.7,8.51 55.88,8.51 57.15,7.24 | v50.67,47.5 50.8,47.37 50.8,42.83 v50.83,42.8 | U$1.PD10 56.39,58.17 v49.91,51.69
  Bottom 0.203: v51.31,38.73 51.18,38.86 51.18,42.39 50.82,42.75 v50.83,42.8 | v50.67,47.5 50.67,50.93 v49.91,51.69
P1SW  (via drill 0.35)
  Top 0.203: v52.07,19.81 52.32,19.56 52.32,12.06 v53.34,11.05
  Bottom 0.203: U$1.PD12 55.37,56.64 55.37,26.42 55.12,26.16 53.29,26.16 52.07,24.95 v52.07,19.81 | v53.34,11.05 53.72,10.67 53.72,7.24 SV1.2
P2L1
  Top 0.203: U$1.PB15 64.26,55.37 64.26,16.13 73.64,6.76 73.64,5.11 SV1.17
P2L2
  Top 0.203: U$1.PD9 63.2,53.9 63.2,14.53 71.09,6.63 71.09,5.11 SV1.15
P2SW
  Bottom 0.203: U$1.PD11 59.44,55.12 59.44,36.83 63.75,32.51 63.75,19.18 68.58,14.35 68.58,5.08 SV1.13
P3L1  (via drill 0.35)
  Top 0.203: SV1.11 68.58,5.08 68.58,8.08 62.77,13.9 62.77,27.05 v62.13,27.69
  Bottom 0.203: v62.13,27.69 56.9,27.69 U$1.PD6
P3L2
  Top 0.203: SV1.9 64.77,3.05 64.01,2.29 61.47,2.29 60.71,3.05 60.71,7.75 58.93,9.53 58.93,25.15 57.91,26.16 55.37,26.16 U$1.PD7
P3SW
  Top 0.203: SV1.7 61.98,3.81 61.09,4.7 61.09,8 59.44,9.65 59.44,26.67 57.4,28.7 55.37,28.7 U$1.PD5
P4L1
  Top 0.203: U$1.PB8 58.42,18.03 58.42,4.83 59.44,3.81 SV1.5
P4L2  (via drill 0.35)
  Top 0.203: U$1.PB7 52.83,21.08 52.83,13.72 v54.61,11.94
  Bottom 0.203: v54.61,11.94 54.61,8.89 55.88,7.62 55.88,5.08 SV1.3
P4SW
  Bottom 0.203: SV1.1 52.07,6.35 52.07,11.18 55.37,14.48 55.37,21.08 U$1.PB6
PANEL_A
  Top 0.203: U$1.PD0 60.96,30.73 60.96,12.83 67.31,6.48 SV1.12
PANEL_B
  Top 0.203: U$1.PD2 60.53,28.63 60.53,12.57 64.77,8.33 SV1.10
PANEL_C
  Top 0.203: U$1.PD4 59.97,26.64 59.97,12.45 62.23,10.19 SV1.8

### Text on the board
tPlace: + | PWR | DART | PEDALS